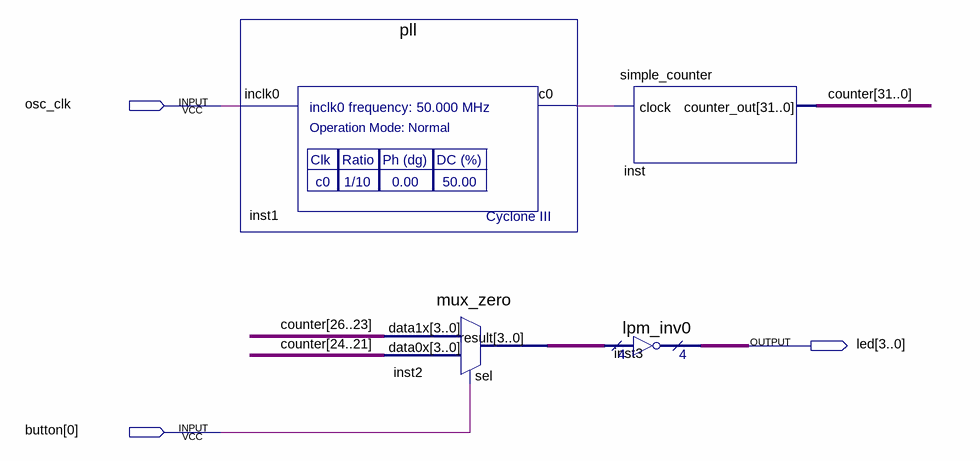
[diagram p0: schematic sheet]
// Quartus schematic cycloneIII_3c25_start_my_first_fpga_top.bdf as structural Verilog: 4 symbols, 3 pins
module cycloneIII_3c25_start_my_first_fpga_top (
  input  osc_clk,
  input  [0:0] button,
  output [3:0] led
);

  wire inst1_c0;
  wire [3:0] inst2_result;
  wire [31:0] counter;

  pll inst1 (.inclk0(osc_clk), .c0(inst1_c0));
  mux_zero inst2 (.data1x(counter[26:23]), .data0x(counter[24:21]), .sel(button[0]), .result(inst2_result));
  simple_counter inst (.clock(inst1_c0), .counter_out(counter));
  lpm_inv0 inst3 (.data(inst2_result), .result(led));
endmodule
